# Altium schematic sheet child_altium-designer.schdoc
size 229 x 219 mm
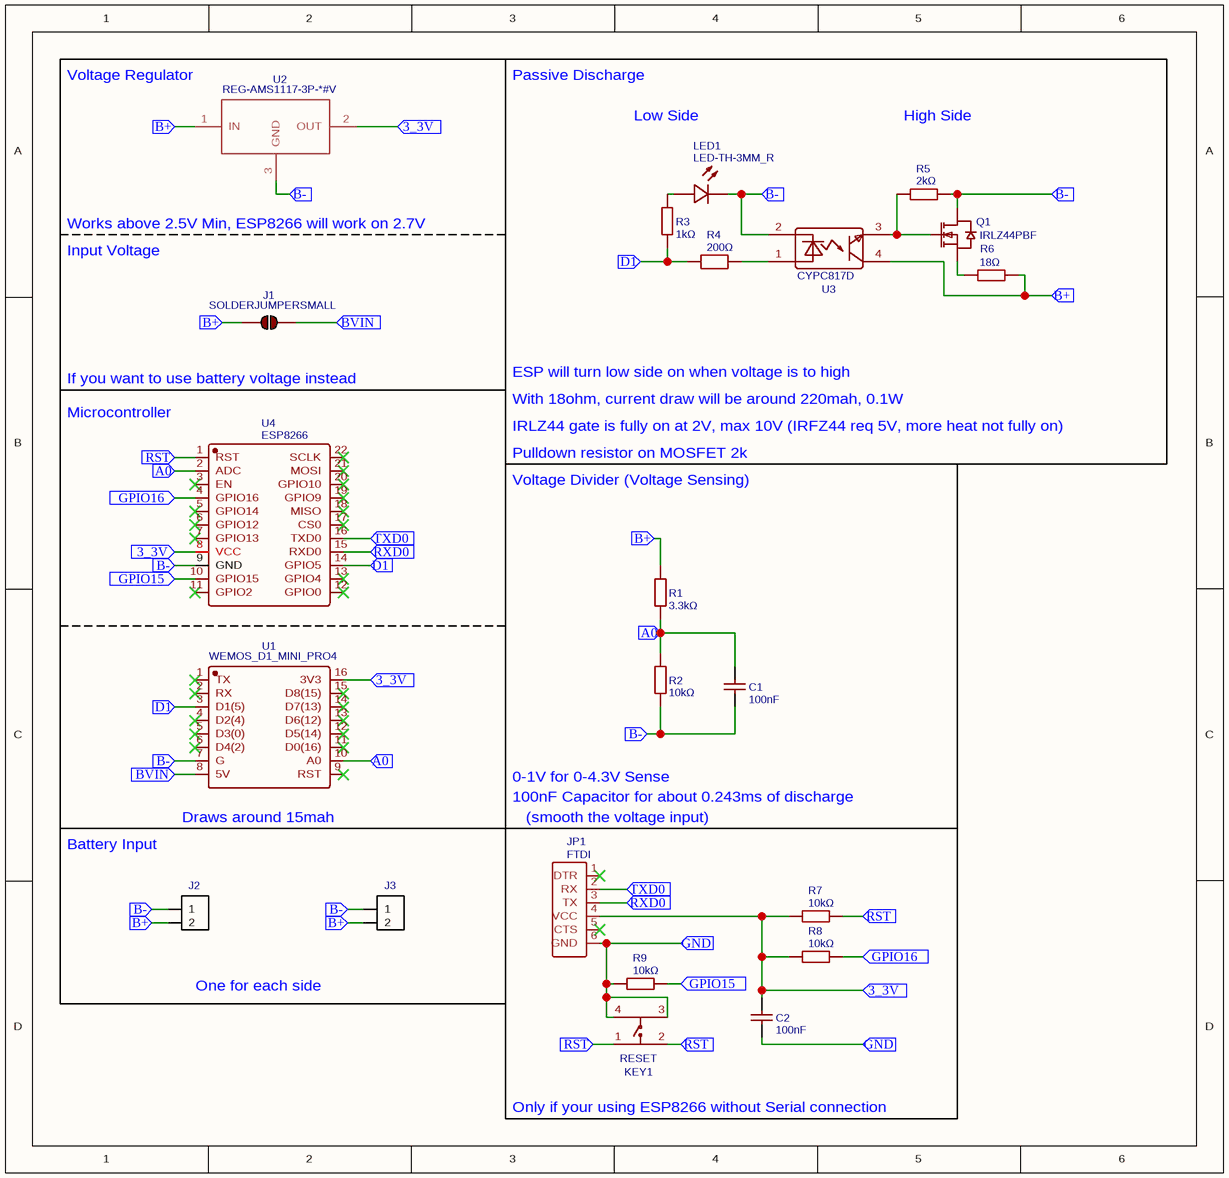
[diagram p0: child_altium-designer.schdoc]

## Parts
C1  100nF  [CAP-TH_L7.6-W3.8-P5.08-D0.51]
C2  100nF  [CAP-TH_L7.6-W3.8-P5.08-D0.51]
J1  SOLDERJUMPERSMALL  [SOLDERJUMPERSMALL]
J2  NO  [CONNECTOR_PINHEADER_2.54MM:PINHEADER_1X11_P_2.54MM]  (value not drawn)
J3  NO  [CONNECTOR_PINHEADER_2.54MM:PINHEADER_1X11_P_2.54MM]  (value not drawn)
JP1  FTDI  [FTDI]
KEY1  RESET  [KEY-TH_4P-L6.0-W6.0-P4.50-LS7.5]
LED1  LED-TH-3MM_R  [LED-TH_BD5.4-P2.54-FD_RED]
Q1  IRLZ44PBF  [TO-220AB-3_L10.4-W4.6-P2.54-L]
R1  3.3kΩ  [RES-TH_BD2.4-L6.3-P10.30-D0.6]
R2  10kΩ  [RES-TH_BD2.2-L6.5-P10.50-D0.6]
R3  1kΩ  [RES-TH_BD2.4-L6.3-P10.30-D0.6]
R4  200Ω  [RES-TH_BD2.7-L6.2-P10.20-D0.4]
R5  2kΩ  [RES-TH_BD2.4-L6.3-P10.30-D0.6]
R6  18Ω  [RES-TH_BD2.3-L6.5-P10.50-D0.5]
R7  10kΩ  [RES-TH_BD2.4-L6.3-P10.30-D0.6]
R8  10kΩ  [RES-TH_BD2.4-L6.3-P10.30-D0.6]
R9  10kΩ  [RES-TH_BD2.4-L6.3-P10.30-D0.6]
U1  WEMOS_D1_MINI_PRO4  [DIP-16_WEMOS_D1_MINI_PRO4]
U2  REG-AMS1117-3P-*#V  [REG-AMS1117-3P#V]
U3  CYPC817D  [DIP-4_L6.4-W4.6-P2.54-LS7.6-BL]
U4  ESP8266  [WIFIM-SMD_ESP-12F-ESP8266MOD]

## Ports
3_3V (in), A0 (in), B+ (in), B- (in), BVIN (in), D1 (in), GND (in), GPIO15 (in), GPIO16 (in), RST (in), RXD0 (in), TXD0 (in)

## Nets
3_3V: C2.1 JP1.4(VCC) R7.2 R8.2 U1.16(3V3) U2.2(OUT) U4.8(VCC) ; port 3_3V
A0: C1.1 R1.2 R2.1 U1.10(A0) U4.2(ADC) ; port A0
B+: J1.1 J2.2 J3.2 R1.1 R6.2 U2.1(IN) U3.4(COL) ; port B+
B-: C1.2 J2.1 J3.1 LED1.2 Q1.2(D) R2.2 R5.2 U1.7(G) U2.3(GND) U3.2(CAT) U4.9(GND) ; port B-
BVIN: J1.2 U1.8(5V) ; port BVIN
D1: R3.1 R4.1 U1.3(D1(5)) U4.14(GPIO5) ; port D1
GND: C2.2 JP1.6(GND) KEY1.3 KEY1.4 R9.2 ; port GND
GPIO15: R9.1 U4.10(GPIO15) ; port GPIO15
GPIO16: R8.1 U4.4(GPIO16) ; port GPIO16
RST: KEY1.1 KEY1.2 R7.1 U4.1(RST) ; port RST
RXD0: JP1.3(TX) U4.15(RXD0) ; port RXD0
TXD0: JP1.2(RX) U4.16(TXD0) ; port TXD0
NetLED1_1: LED1.1 R3.2
NetQ1_1: Q1.1(G) R5.1 U3.3(EM)
NetQ1_3: Q1.3(S) R6.1
NetR4_2: R4.2 U3.1(AN)

Not connected (* = marked no-connect by the designer): JP1 1(DTR)* 5(CTS)*; U1 1(TX)* 2(RX)* 4(D2(4))* 5(D3(0))* 6(D4(2))* 9(RST)* 11(D0(16))* 12(D5(14))* 13(D6(12))* 14(D7(13))* 15(D8(15))*; U4 3(EN)* 5(GPIO14)* 6(GPIO12)* 7(GPIO13)* 11(GPIO2)* 12(GPIO0)* 13(GPIO4)* 17(CS0)* 18(MISO)* 19(GPIO9)* 20(GPIO10)* 21(MOSI)* 22(SCLK)*

## Notes on the sheet
- (near U2) Voltage Regulator
- Passive Discharge
- Low Side
- High Side
- Works above 2.5V Min, ESP8266 will work on 2.7V
- Input Voltage
- If you want to use battery voltage instead
- ESP will turn low side on when voltage is to high
- (near U4) Microcontroller
- With 18ohm, current draw will be around 220mah, 0.1W
- IRLZ44 gate is fully on at 2V, max 10V (IRFZ44 req 5V, more heat not fully on)
- Pulldown resistor on MOSFET 2k
- Voltage Divider (Voltage Sensing)
- 0-1V for 0-4.3V Sense
- Battery Input
- (near U1) Draws around 15mah
- 100nF Capacitor for about 0.243ms of discharge
- (near JP1) (smooth the voltage input)
- One for each side
- Only if your using ESP8266 without Serial connection

## Library data of the parts
C1 C2 = 100nF: Manufacturer: Kyocera AVX; Manufacturer Part: SR305C105KAR; nameAlias: Value; Contributor: LCSC; Supplier: LCSC; Supplier Part: C444741; JLCPCB Part Class: Extended Part; link: https://lcsc.com/eda_search?q=C444741&%26type=1&ref=editor; spicePre: C; spiceSymbolName: SR305C105KAR
J1 = SOLDERJUMPERSMALL: Contributor: stefan.klaeui; spicePre: J; spiceSymbolName: SOLDERJUMPERSMALL
J2 J3 = NO: Manufacturer: BOOMELE; Manufacturer Part: Female headerHDR1X8-2.54; Contributor: Jacob KUNNATHOOR; Supplier: LCSC; Supplier Part: C27438; JLCPCB Part Class: Extended Part; spicePre: P; spiceSymbolName: Header-Female-2.54_1x2
JP1 = FTDI: Contributor: SparkFun; spicePre: J; spiceSymbolName: FTDI
KEY1 = RESET: Manufacturer: ReliaPro; Manufacturer Part: button6*6*8; Supplier Part: C59982; Supplier: LCSC; JLCPCB Part Class: Extended Part; link: https://lcsc.com/eda_search?q=C59982&%26type=1&ref=editor; spicePre: K; spiceSymbolName: button6*6*8
LED1 = LED-TH-3MM_R: Manufacturer: null; Contributor: LCSC; Supplier: LCSC; Supplier Part: C9900003210; Manufacturer Part: LED-TH-3mm_R; JLCPCB Part Class: Extended Part; link: https://lcsc.com/eda_search?q=C9900003210&%26type=1&ref=editor; spicePre: U; spiceSymbolName: LED-TH-3MM_R
Q1 = IRLZ44PBF: Manufacturer: VBsemi(微碧); Manufacturer Part: IRLZ44PBF-VB; Contributor: LCSC; Supplier: LCSC; Supplier Part: C2680731; JLCPCB Part Class: Extended Part; link: https://lcsc.com/eda_search?q=C2680731&%26type=1&ref=editor; spicePre: Q; spiceSymbolName: IRLZ44PBF
R1 = 3.3kΩ: Manufacturer: YAGEO(国巨); Manufacturer Part: MFR-25FTE52-33K; nameAlias: Value; Contributor: LCSC; Supplier: LCSC; Supplier Part: C173005; JLCPCB Part Class: Extended Part; link: https://lcsc.com/eda_search?q=C173005&%26type=1&ref=editor; spicePre: R; spiceSymbolName: MFR-25FTE52-33K
R2 = 10kΩ: Manufacturer: YAGEO(国巨); Manufacturer Part: MFR-25FTE52-100K; nameAlias: Value; Contributor: LCSC; Supplier: LCSC; Supplier Part: C172965; JLCPCB Part Class: Extended Part; link: https://lcsc.com/eda_search?q=C172965&%26type=1&ref=editor; spicePre: R; spiceSymbolName: MFR-25FTE52-100K
R3 = 1kΩ: Manufacturer: YAGEO(国巨); Manufacturer Part: MFR50SFTE52-1K; nameAlias: Value; Contributor: LCSC; Supplier: LCSC; Supplier Part: C173143; JLCPCB Part Class: Extended Part; link: https://lcsc.com/eda_search?q=C173143&%26type=1&ref=editor; spicePre: R; spiceSymbolName: MFR50SFTE52-1K
R4 = 200Ω: Manufacturer: VO(翔胜); Manufacturer Part: CR1/4W-200Ω±5%-ST52; Contributor: lcsc; nameAlias: Value; Supplier: LCSC; Supplier Part: C2894669; JLCPCB Part Class: Extended Part; link: https://lcsc.com/eda_search?q=C2894669&%26type=1&ref=editor; spicePre: R; spiceSymbolName: CR1/4W-200Ω±5%-ST52
R5 = 2kΩ: Manufacturer: YAGEO(国巨); Manufacturer Part: MFR-25FTE52-2K; nameAlias: Value; Contributor: LCSC; Supplier: LCSC; Supplier Part: C172996; JLCPCB Part Class: Extended Part; link: https://lcsc.com/eda_search?q=C172996&%26type=1&ref=editor; spicePre: R; spiceSymbolName: MFR-25FTE52-2K
R6 = 18Ω: Manufacturer: CCO(千志电子); Manufacturer Part: CF1/4W-18Ω±5% T; nameAlias: Value; Contributor: LCSC; Supplier: LCSC; Supplier Part: C120013; JLCPCB Part Class: Extended Part; link: https://lcsc.com/eda_search?q=C120013&%26type=1&ref=editor; spicePre: R; spiceSymbolName: CF1/4W-18Ω±5% T52
R7-R9 = 10kΩ: Manufacturer: YAGEO(国巨); Manufacturer Part: MFR-25FTE52-33K; nameAlias: Value; Contributor: LCSC; Supplier: LCSC; Supplier Part: C173005; JLCPCB Part Class: Extended Part; link: https://lcsc.com/eda_search?q=C173005&%26type=1&ref=editor; spicePre: R; spiceSymbolName: MFR-25FTE52-33K
U1 = WEMOS_D1_MINI_PRO4: Manufacturer: null; Contributor: LCSC; Supplier: LCSC; Supplier Part: C2837266; Manufacturer Part: Wemos_D1_mini_Pro4; JLCPCB Part Class: Extended Part; link: https://lcsc.com/eda_search?q=C2837266&%26type=1&ref=editor; spicePre: U; spiceSymbolName: WEMOS_D1_MINI_PRO4
U2 = REG-AMS1117-3P-*#V: Contributor: jboutin; spicePre: ?; spiceSymbolName: REG-AMS1117-3P-*#V
U3 = CYPC817D: Manufacturer: OCIC(卓睿科); Contributor: lcsc; Supplier: LCSC; Supplier Part: C3018787; Manufacturer Part: CYPC817D; JLCPCB Part Class: Extended Part; link: https://lcsc.com/eda_search?q=C3018787&%26type=1&ref=editor; spicePre: U; spiceSymbolName: CYPC817D
U4 = ESP8266: Manufacturer: null; Contributor: LCSC; LINK: https://img.jlc.com/image//data/smt-stock-produce/componentSizePhoto/2021-12-02/b5eb61357b2a478295008aee8c894ebd/BG2111290693_D21112900056_font.png; Supplier: LCSC; Supplier Part: C9900003049; Manufacturer Part: ESP8266; JLCPCB Part Class: Extended Part; link: https://lcsc.com/eda_search?q=C9900003049&%26type=1&ref=editor; spicePre: U; spiceSymbolName: ESP8266